# EAGLE design TempGuard (EAGLE 9.6.1)
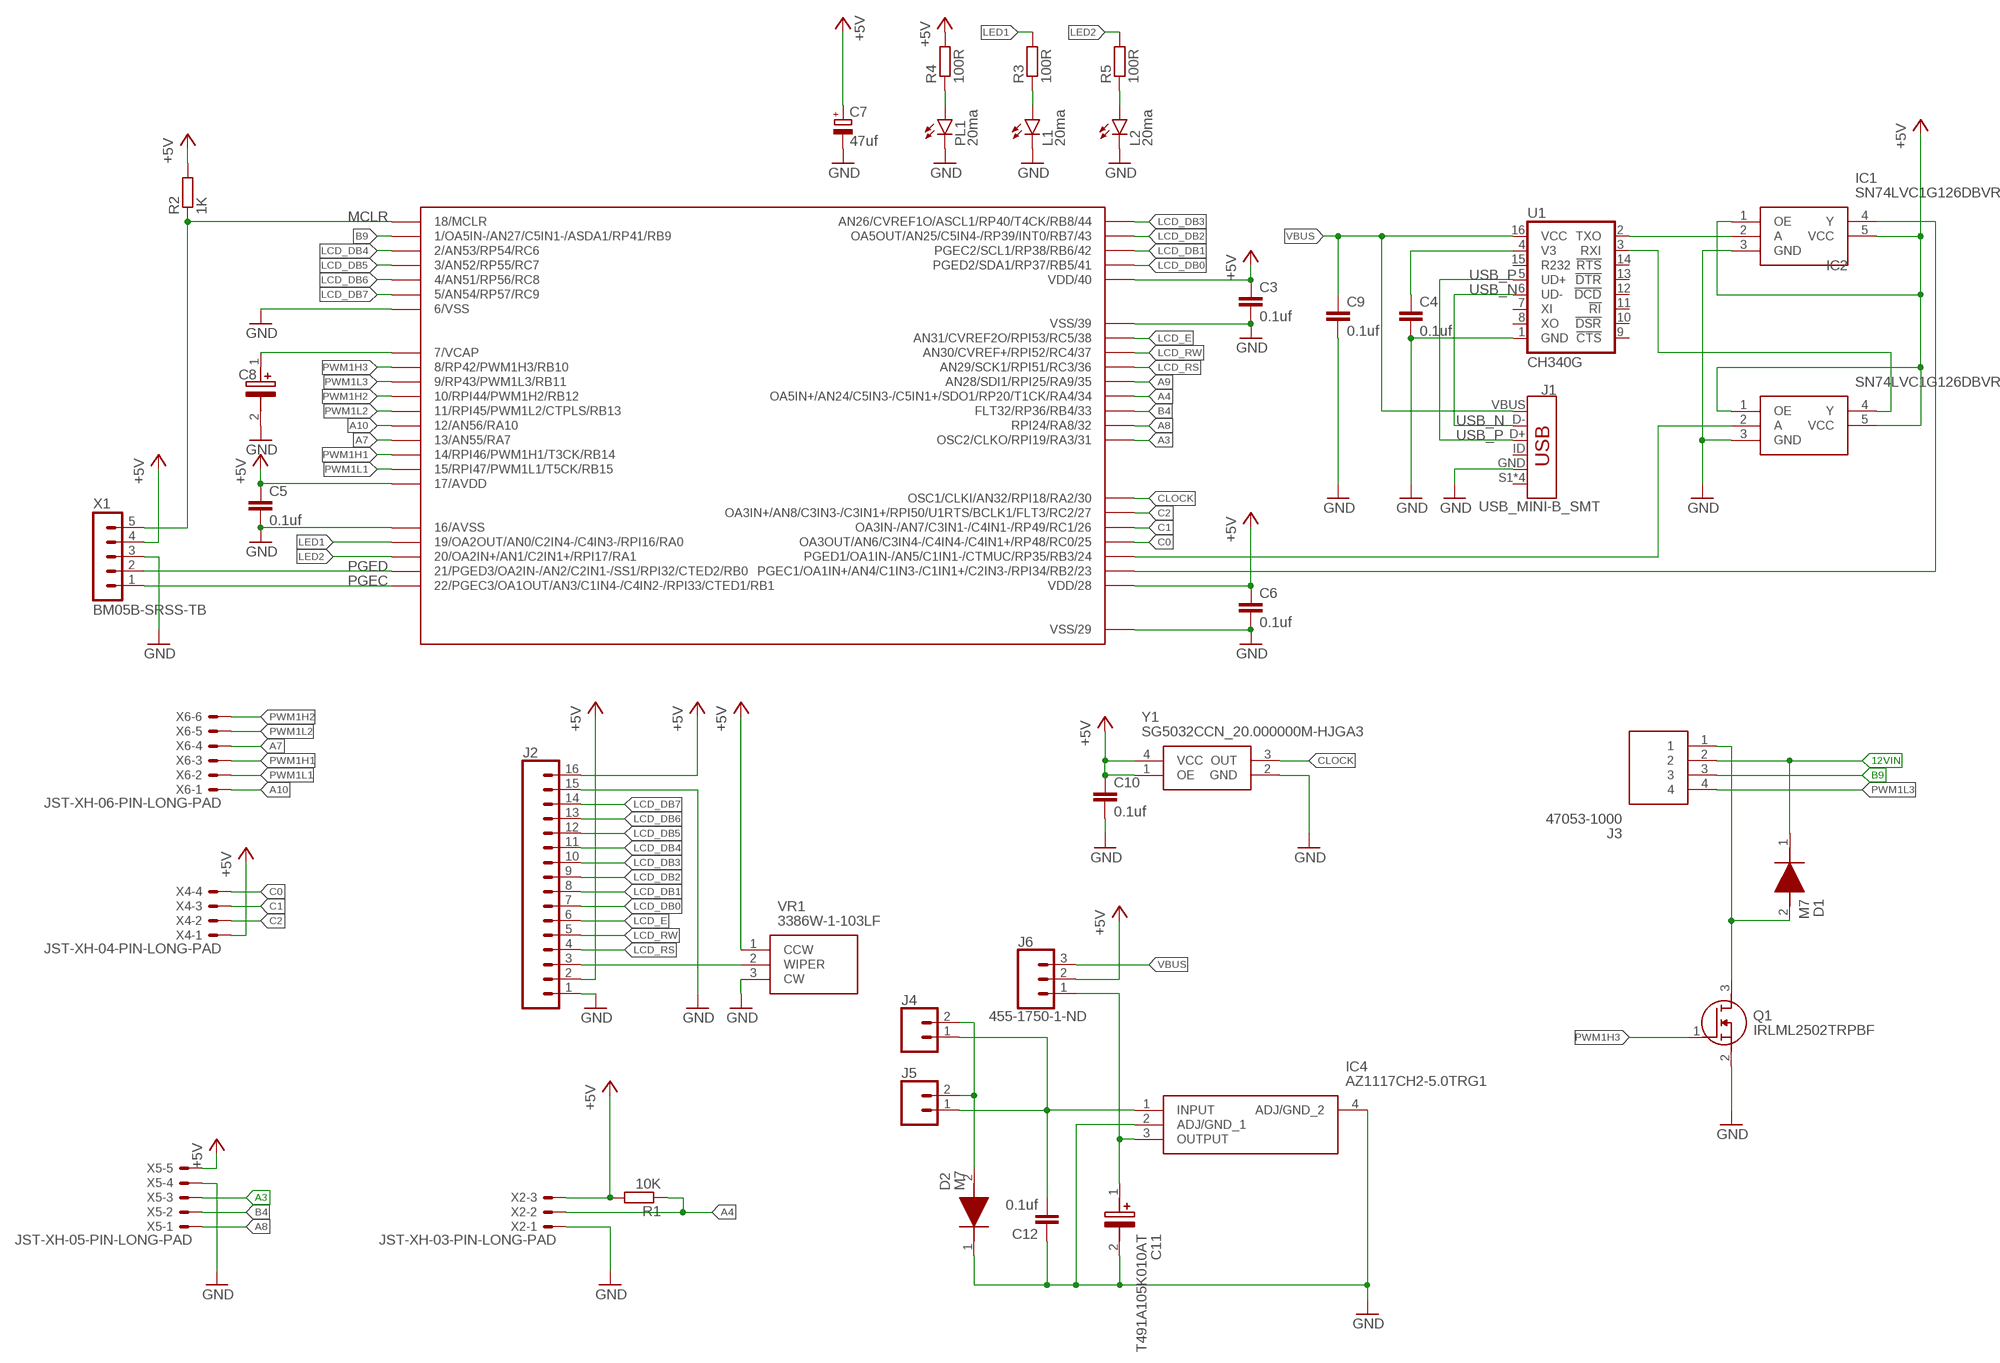
[diagram p0: schematic, sheet 1]

## Parts
C3  0.1uf  C-EUC0805  [C0805]
C4  0.1uf  C-EUC0805  [C0805]
C5  0.1uf  C-EUC0805  [C0805]
C6  0.1uf  C-EUC0805  [C0805]
C7  47uf  CPOL-EUE2-5  [E2-5]
C8  TR3B106K020C1000  [CAPPM3528X210N]
C9  0.1uf  C-EUC0805  [C0805]
C10  0.1uf  C-EUC0805  [C0805]
C11  T491A105K010AT  [T491A]
C12  0.1uf  C-EUC0805  [C0805]
D1  M7  [DIOM5327X240N]
D2  M7  [DIOM5327X240N]
IC1  SN74LVC1G126DBVR  [SOT95P280X145-5N]
IC2  SN74LVC1G126DBVR  [SOT95P280X145-5N]
IC4  AZ1117CH2-5.0TRG1  [SOT230P700X180-4N]
J1  USB_MINI-B_SMT  [USB-MINIB]
J2  CONN_16LONGPADS  [1X16_LONGPADS]
J3  47053-1000  [470531000]
J4  CONN_025MM  [SCREWTERMINAL-5MM-2]
J5  CONN_025MM  [SCREWTERMINAL-5MM-2]
J6  455-1750-1-ND  CONN_03  [1X03]
L1  20ma  LEDSML0805  [SML0805]
L2  20ma  LEDSML0805  [SML0805]
MCU1  DSPIC33EV64GM004-I/PT  [QFP80P1200X1200X120-44]
PL1  20ma  LEDSML0805  [SML0805]
Q1  IRLML2502TRPBF  [SOT95P237X112-3N]
R1  10K  R-EU_R0805  [R0805]
R2  1K  R-EU_R0805  [R0805]
R3  100R  R-EU_R0805  [R0805]
R4  100R  R-EU_R0805  [R0805]
R5  100R  R-EU_R0805  [R0805]
U1  CH340G  CH340GSMD  [SO016]
VR1  3386W-1-103LF  [3386W]
X1  BM05B-SRSS-TB  [BM05B-SRSS-TB]
X2  JST-XH-03-PIN-LONG-PAD  [JST-XH-03-PACKAGE-LONG-PAD]
X4  JST-XH-04-PIN-LONG-PAD  [JST-XH-04-PACKAGE-LONG-PAD]
X5  JST-XH-05-PIN-LONG-PAD  [JST-XH-05-PACKAGE-LONG-PAD]
X6  JST-XH-06-PIN-LONG-PAD  [JST-XH-06-PACKAGE-LONG-PAD]
Y1  SG5032CCN_20.000000M-HJGA3  [SG5032CCN20000000MHJGA3]

## Nets
12VIN [logic]: C12.2 D1.1(K) IC4.1(INPUT) J3.2 J4.1 J5.1
+5V [power]: C3.1 C5.1 C6.1 C7.+ C10.1 IC1.1(OE) IC1.5(VCC) IC2.1(OE) IC2.5(VCC) J2.2 J2.16 J6.2 MCU1.17(17/AVDD) MCU1.28(VDD/28) MCU1.40(VDD/40) R1.2 R2.2 R4.2 VR1.1(CCW) X1.4 X2.3 X4.1 X5.5 Y1.1(OE) Y1.4(VCC)
A3 [logic]: MCU1.31(OSC2/CLKO/RPI19/RA3/31) X5.3
A4 [logic]: MCU1.34(OA5IN+/AN24/C5IN3-/C5IN1+/SDO1/RP20/T1CK/RA4/34) R1.1 X2.2
A7 [logic]: MCU1.13(13/AN55/RA7) X6.4
A8 [logic]: MCU1.32(RPI24/RA8/32) X5.1
A9 [logic]: MCU1.35(AN28/SDI1/RPI25/RA9/35)
A10 [logic]: MCU1.12(12/AN56/RA10) X6.1
B4 [logic]: MCU1.33(FLT32/RP36/RB4/33) X5.2
B9 [logic]: J3.3 MCU1.1(1/OA5IN-/AN27/C5IN1-/ASDA1/RP41/RB9)
C0 [logic]: MCU1.25(OA3OUT/AN6/C3IN4-/C4IN4-/C4IN1+/RP48/RC0/25) X4.4
C1 [logic]: MCU1.26(OA3IN-/AN7/C3IN1-/C4IN1-/RP49/RC1/26) X4.3
C2 [logic]: MCU1.27(OA3IN+/AN8/C3IN3-/C3IN1+/RPI50/U1RTS/BCLK1/FLT3/RC2/27) X4.2
CLOCK [logic]: MCU1.30(OSC1/CLKI/AN32/RPI18/RA2/30) Y1.3(OUT)
GND [power]: C3.2 C4.2 C5.2 C6.2 C7.- C8.2(-) C9.2 C10.2 C11.2(-) C12.1 D2.1(K) IC1.3(GND) IC2.3(GND) IC4.2(ADJ/GND_1) IC4.4(ADJ/GND_2) J1.GND J2.1 J2.15 L1.C L2.C MCU1.6(6/VSS) MCU1.16(16/AVSS) MCU1.29(VSS/29) MCU1.39(VSS/39) PL1.C Q1.2(S) U1.1(GND) VR1.3(CW) X1.3 X2.1 X5.4 Y1.2(GND)
LCD_DB0 [logic]: J2.7 MCU1.41(PGED2/SDA1/RP37/RB5/41)
LCD_DB1 [logic]: J2.8 MCU1.42(PGEC2/SCL1/RP38/RB6/42)
LCD_DB2 [logic]: J2.9 MCU1.43(OA5OUT/AN25/C5IN4-/RP39/INT0/RB7/43)
LCD_DB3 [logic]: J2.10 MCU1.44(AN26/CVREF1O/ASCL1/RP40/T4CK/RB8/44)
LCD_DB4 [logic]: J2.11 MCU1.2(2/AN53/RP54/RC6)
LCD_DB5 [logic]: J2.12 MCU1.3(3/AN52/RP55/RC7)
LCD_DB6 [logic]: J2.13 MCU1.4(4/AN51/RP56/RC8)
LCD_DB7 [logic]: J2.14 MCU1.5(5/AN54/RP57/RC9)
LCD_E [logic]: J2.6 MCU1.38(AN31/CVREF2O/RPI53/RC5/38)
LCD_RS [logic]: J2.4 MCU1.36(AN29/SCK1/RPI51/RC3/36)
LCD_RW [logic]: J2.5 MCU1.37(AN30/CVREF+/RPI52/RC4/37)
LED1 [logic]: MCU1.19(19/OA2OUT/AN0/C2IN4-/C4IN3-/RPI16/RA0) R3.2
LED2 [logic]: MCU1.20(20/OA2IN+/AN1/C2IN1+/RPI17/RA1) R5.2
MCLR [logic]: MCU1.18(18/MCLR) R2.1 X1.5
N$1 [logic]: C4.1 U1.4(V3)
N$2 [logic]: L1.A R3.1
N$3 [power]: D1.2(A) J3.1 Q1.3(D)
N$4 [logic]: IC1.2(A) U1.2(TXO)
N$5 [logic]: J2.3 VR1.2(WIPER)
N$6 [logic]: PL1.A R4.1
N$7 [logic]: L2.A R5.1
N$8 [power]: D2.2(A) J4.2 J5.2
N$9 [power]: C11.1(+) IC4.3(OUTPUT) J6.1
N$14 [logic]: IC2.4(Y) U1.3(RXI)
PGEC [logic]: MCU1.22(22/PGEC3/OA1OUT/AN3/C1IN4-/C4IN2-/RPI33/CTED1/RB1) X1.1
PGED [logic]: MCU1.21(21/PGED3/OA2IN-/AN2/C2IN1-/SS1/RPI32/CTED2/RB0) X1.2
PWM1H1 [logic]: MCU1.14(14/RPI46/PWM1H1/T3CK/RB14) X6.3
PWM1H2 [logic]: MCU1.10(10/RPI44/PWM1H2/RB12) X6.6
PWM1H3 [logic]: MCU1.8(8/RP42/PWM1H3/RB10) Q1.1(G)
PWM1L1 [logic]: MCU1.15(15/RPI47/PWM1L1/T5CK/RB15) X6.2
PWM1L2 [logic]: MCU1.11(11/RPI45/PWM1L2/CTPLS/RB13) X6.5
PWM1L3 [logic]: J3.4 MCU1.9(9/RP43/PWM1L3/RB11)
U1RX [logic]: IC1.4(Y) MCU1.23(PGEC1/OA1IN+/AN4/C1IN3-/C1IN1+/C2IN3-/RPI34/RB2/23)
U1TX [logic]: IC2.2(A) MCU1.24(PGED1/OA1IN-/AN5/C1IN1-/CTMUC/RP35/RB3/24)
USB_N [logic]: J1.D- U1.6(UD-)
USB_P [logic]: J1.D+ U1.5(UD+)
VBUS [logic]: C9.1 J1.VBUS J6.3 U1.16(VCC)
VCAP [logic]: C8.1(+) MCU1.7(7/VCAP)
Unconnected: J1.ID J1.S1(SHIELD) J1.S2(SHIELD) J1.S3(SHIELD) J1.S4(SHIELD) U1.7(XI) U1.8(XO) U1.9(!CTS) U1.10(!DSR) U1.11(!RI) U1.12(!DCD) U1.13(!DTR) U1.14(!RTS) U1.15(R232)

## Library data of the parts
C3-C6 C9 C10 C12 = rcl:C-EU: CAPACITOR, European symbol; SPICEPREFIX: C
C7 = rcl:CPOL-EU: POLARIZED CAPACITOR, European symbol; SPICEPREFIX: C
C8 = Angelo-Capacitors:TR3B106K020C1000: Solid Tantalum Surface Mount Chip Capacitors TANTAMOUNT(TM), Molded Case, Low ESR Source: Datasheet <http://www.vishay.com/doc?40080>; ALLIED_NUMBER: 70396682; DESCRIPTION: Solid Tantalum Surface Mount Chip Capacitors TANTAMOUNT(TM), Molded Case, Low ESR; HEIGHT: 2.1mm; MANUFACTURER_NAME: Vishay; MANUFACTURER_PART_NUMBER: TR3B106K020C1000; RS_PART_NUMBER: 6845020; RS_PRICE-STOCK: https://uk.rs-online.com/web/p/products/6845020; VALUEX: 10uF
C11 = T491A105K010AT:T491A105K010AT: T491, Tantalum, MnO2 Tantalum, Commercial Grade, 1 uF, 10%, 10 VDC, 125C, -55C, 85C, SMD, MnO2, Molded, 4 % , 10 Ohms, 500 nA, 58.6 mg, 3216, 1.6mm, Height Max = 1.8mm, 2000, 156 Weeks Source: Datasheet <https://content.kemet.com/datasheets/KEM_T2005_T491.pdf>; DESCRIPTION: T491, Tantalum, MnO2 Tantalum, Commercial Grade, 1 uF, 10%, 10 VDC, 125C, -55C, 85C, SMD, MnO2, Molded, 4 % , 10 Ohms, 500 nA, 58.6 mg, 3216, 1.6mm, Height Max = 1.8mm, 2000, 156 Weeks; HEIGHT: 1.8mm; MANUFACTURER_NAME: KEMET; MANUFACTURER_PART_NUMBER: T491A105K010AT; MOUSER_PART_NUMBER: 80-T491A105K010AT; MOUSER_PRICE-STOCK: https://www.mouser.co.uk/ProductDetail/KEMET/T491A105K010AT?qs=AaRlLUpeMswm%2FLee9GNRtw%3D%3D
D1 D2 = M7:M7: Standard recovery rectifier diode Source: Datasheet <https://www.mouser.in/datasheet/2/849/m1-2577421.pdf>; DESCRIPTION: Standard recovery rectifier diode; HEIGHT: 2.4mm; MANUFACTURER_NAME: Diotec; MANUFACTURER_PART_NUMBER: M7; MOUSER_PART_NUMBER: 637-M7; MOUSER_PRICE-STOCK: https://www.mouser.co.uk/ProductDetail/Diotec-Semiconductor/M7?qs=OlC7AqGiEDln9itgkDD%2F2A%3D%3D
IC1 IC2 = SN74LVC1G126DBVR:SN74LVC1G126DBVR: Texas Instruments SN74LVC1G126DBVR, Buffer 3-State, Non-Inverting, 1.65 5.5 V, 5-Pin SOT-23 Source: Datasheet <http://www.ti.com/lit/ds/symlink/sn74lvc1g126.pdf>; DESCRIPTION: Texas Instruments SN74LVC1G126DBVR, Buffer 3-State, Non-Inverting, 1.65 5.5 V, 5-Pin SOT-23; HEIGHT: 1.45mm; MANUFACTURER_NAME: Texas Instruments; MANUFACTURER_PART_NUMBER: SN74LVC1G126DBVR; MOUSER_PART_NUMBER: 595-SN74LVC1G126DBVR; MOUSER_PRICE-STOCK: https://www.mouser.co.uk/ProductDetail/Texas-Instruments/SN74LVC1G126DBVR?qs=pajgIaoyDUi3T2WgNNfd3w%3D%3D
IC4 = AZ1117CH2-5.0TRG1:AZ1117CH2-5.0TRG1: LDO Voltage Regulators LDO BJT HiCurr Source: Datasheet <https://www.arrow.com/en/products/az1117ch2-5.0trg1/diodes-incorporated>; DESCRIPTION: LDO Voltage Regulators LDO BJT HiCurr; HEIGHT: 1.8mm; MANUFACTURER_NAME: Diodes Incorporated; MANUFACTURER_PART_NUMBER: AZ1117CH2-5.0TRG1; MOUSER_PART_NUMBER: 621-AZ1117CH2-5.0TRG; MOUSER_PRICE-STOCK: https://www.mouser.co.uk/ProductDetail/Diodes-Incorporated/AZ1117CH2-5.0TRG1?qs=5V6w%252Be2aIqb578qtLdqPjw%3D%3D
J1 = SparkFun-Connectors:USB_MINI-B: USB type Mini-B Connector Breaks out 5th pin, and includes shield pins if needed. SparkFun Products: SparkFun FTDI Basic Breakout <https://www.sparkfun.com/products/9716> SparkFun XBee Explorer USB <https://www.sparkfun.com/products/11812> SparkFun Redboard <https://www.sparkfun.com/products/12757>; PROD_ID: CONN-08193; SF_ID: PRT-00587
J2 = SparkFun-Connectors:CONN_16: Multi connection point. Often used as Generic Header-pin footprint for 0.1 inch spaced/style header connections On any of the 0.1 inch spaced packages, you can populate with these: Break Away Headers - Straight <https://www.sparkfun.com/products/116> (PRT-00116) Break Away Male Headers - Right Angle <https://www.sparkfun.com/products/553> (PRT-00553) Female Headers <https://www.sparkfun.com/products/115> (PRT-00115) Break Away Headers - Machine Pin <https://www.sparkfun.com/products/117> (PRT-00117) Break Away Female Headers - Swiss Machine Pin <https://www.sparkfun.com/products/743> (PRT-00743) For SCREWTERMINALS and SPRING TERMINALS visit here: Screw Terimnals on SparkFun.com <https://www.sparkfun.com/search/results?term=Screw+Terminals> (5mm/3.5mm/2.54mm spacing) This device is also useful as a general connection point to wire up your design to another part of your project. Our various solder wires solder well into these plated through hole pads. Hook-Up Wire - Assortment (Stranded, 22 AWG) <https://www.sparkfun.com/products/11375> (PRT-11375) Hook-Up Wire - Assortment (Solid Core, 22 AWG) <https://www.sparkfun.com/products/11367> (PRT-11367) View the entire wire category on our website here <https://www.sparkfun.com/categories/141> Special notes: Molex polarized connector foot print use with SKU : PRT-08231 with associated crimp pins and housings. 1MM SMD Version SKU: PRT-10208 NOTES ON THE VARIANTS LOCK and LOCK_LONGPADS... This footprint was designed to help hold the alignment of a through-hole component (i.e. 6-pin header) while soldering it into place. You may notice that each hole has been shifted either up or down by 0.005 of an inch from it's more standard position (which is a perfectly straight line). This slight alteration caused the pins (the squares in the middle) to touch the edges of the holes. Because they are alternating, it causes a "brace" to hold the component in place. 0.005 has proven to be the perfect amount of "off-center" position when using our standard breakaway headers. Although looks a little odd when you look at the bare footprint, once you have a header in there, the alteration is very hard to notice. Also,if you push a header all the way into place, it is covered up entirely on the bottom side.
J3 = 47053-1000:47053-1000: MOLEX - 47053-1000 - HEADER, 4POS, 1ROW, 2.54MM Source: Datasheet <http://www.molex.com/pdm_docs/sd/470531000_sd.pdf>; DESCRIPTION: MOLEX - 47053-1000 - HEADER, 4POS, 1ROW, 2.54MM; HEIGHT: 8mm; MANUFACTURER_NAME: Molex; MANUFACTURER_PART_NUMBER: 47053-1000; MOUSER_PART_NUMBER: 538-47053-1000; MOUSER_PRICE-STOCK: https://www.mouser.co.uk/ProductDetail/Molex/47053-1000?qs=ph4zPCVRuvqoDX7hrEhxNA%3D%3D
J4 J5 = SparkFun-Connectors:CONN_02: Multi connection point. Often used as Generic Header-pin footprint for 0.1 inch spaced/style header connections On any of the 0.1 inch spaced packages, you can populate with these: Break Away Headers - Straight <https://www.sparkfun.com/products/116> (PRT-00116) Break Away Male Headers - Right Angle <https://www.sparkfun.com/products/553> (PRT-00553) Female Headers <https://www.sparkfun.com/products/115> (PRT-00115) Break Away Headers - Machine Pin <https://www.sparkfun.com/products/117> (PRT-00117) Break Away Female Headers - Swiss Machine Pin <https://www.sparkfun.com/products/743> (PRT-00743) For SCREWTERMINALS and SPRING TERMINALS visit here: Screw Terimnals on SparkFun.com <https://www.sparkfun.com/search/results?term=Screw+Terminals> (5mm/3.5mm/2.54mm spacing) This device is also useful as a general connection point to wire up your design to another part of your project. Our various solder wires solder well into these plated through hole pads. Hook-Up Wire - Assortment (Stranded, 22 AWG) <https://www.sparkfun.com/products/11375> (PRT-11375) Hook-Up Wire - Assortment (Solid Core, 22 AWG) <https://www.sparkfun.com/products/11367> (PRT-11367) View the entire wire category on our website here <https://www.sparkfun.com/categories/141> Special notes: Molex polarized connector foot print use with: PRT-08233 with associated crimp pins and housings. 2.54_SCREWTERM for use with PRT-10571. 3.5mm Screw Terminal footprints for PRT-08084 5mm Screw Terminal footprints for use with PRT-08432; SF_SKU: PRT-08432
J6 = SparkFun-Connectors:CONN_03: Multi connection point. Often used as Generic Header-pin footprint for 0.1 inch spaced/style header connections On any of the 0.1 inch spaced packages, you can populate with these: Break Away Headers - Straight <https://www.sparkfun.com/products/116> (PRT-00116) Break Away Male Headers - Right Angle <https://www.sparkfun.com/products/553> (PRT-00553) Female Headers <https://www.sparkfun.com/products/115> (PRT-00115) Break Away Headers - Machine Pin <https://www.sparkfun.com/products/117> (PRT-00117) Break Away Female Headers - Swiss Machine Pin <https://www.sparkfun.com/products/743> (PRT-00743) Stackable Header - 3 Pin (Female, 0.1") <https://www.sparkfun.com/products/13875> (PRT-13875) For SCREWTERMINALS and SPRING TERMINALS visit here: Screw Terimnals on SparkFun.com <https://www.sparkfun.com/search/results?term=Screw+Terminals> (5mm/3.5mm/2.54mm spacing) This device is also useful as a general connection point to wire up your design to another part of your project. Our various solder wires solder well into these plated through hole pads. Hook-Up Wire - Assortment (Stranded, 22 AWG) <https://www.sparkfun.com/products/11375> (PRT-11375) Hook-Up Wire - Assortment (Solid Core, 22 AWG) <https://www.sparkfun.com/products/11367> (PRT-11367) View the entire wire category on our website here <https://www.sparkfun.com/categories/141> Special notes: Molex polarized connector foot print use with SKU : PRT-08232 with associated crimp pins and housings.; PROD_ID: XXX-00000
L1 L2 PL1 = led:LED: LED OSRAM: - CHIPLED LG R971, LG N971, LY N971, LG Q971, LY Q971, LO R971, LY R971 LH N974, LH R974 LS Q976, LO Q976, LY Q976 LO Q996 - Hyper CHIPLED LW Q18S LB Q993, LB Q99A, LB R99A - SideLED LS A670, LO A670, LY A670, LG A670, LP A670 LB A673, LV A673, LT A673, LW A673 LH A674 LY A675 LS A676, LA A676, LO A676, LY A676, LW A676 LS A679, LY A679, LG A679 - Hyper Micro SIDELED® LS Y876, LA Y876, LO Y876, LY Y876 LT Y87S - SmartLED LW L88C, LW L88S LB L89C, LB L89S, LG L890 LS L89K, LO L89K, LY L89K LS L896, LA L896, LO L896, LY L896 - TOPLED LS T670, LO T670, LY T670, LG T670, LP T670 LSG T670, LSP T670, LSY T670, LOP T670, LYG T670 LG T671, LOG T671, LSG T671 LB T673, LV T673, LT T673, LW T673 LH T674 LS T676, LA T676, LO T676, LY T676, LB T676, LH T676, LSB T676, LW T676 LB T67C, LV T67C, LT T67C, LS T67K, LO T67K, LY T67K, LW E67C LS E67B, LA E67B, LO E67B, LY E67B, LB E67C, LV E67C, LT E67C LW T67C LS T679, LY T679, LG T679 LS T770, LO T770, LY T770, LG T770, LP T770 LB T773, LV T773, LT T773, LW T773 LH T774 LS E675, LA E675, LY E675, LS T675 LS T776, LA T776, LO T776, LY T776, LB T776 LHGB T686 LT T68C, LB T68C - Hyper Mini TOPLED® LB M676 - Mini TOPLED Santana® LG M470 LS M47K, LO M47K, LY M47K Source: http://www.osram.convergy.de LUXEON: - LUMILED® LXK2-PW12-R00, LXK2-PW12-S00, LXK2-PW14-U00, LXK2-PW14-V00 LXK2-PM12-R00, LXK2-PM12-S00, LXK2-PM14-U00 LXK2-PE12-Q00, LXK2-PE12-R00, LXK2-PE12-S00, LXK2-PE14-T00, LXK2-PE14-U00 LXK2-PB12-K00, LXK2-PB12-L00, LXK2-PB12-M00, LXK2-PB14-N00, LXK2-PB14-P00, LXK2-PB14-Q00 LXK2-PR12-L00, LXK2-PR12-M00, LXK2-PR14-Q00, LXK2-PR14-R00 LXK2-PD12-Q00, LXK2-PD12-R00, LXK2-PD12-S00 LXK2-PH12-R00, LXK2-PH12-S00 LXK2-PL12-P00, LXK2-PL12-Q00, LXK2-PL12-R00 Source: www.luxeon.com KINGBRIGHT: KA-3528ASYC Source: www.kingbright.com
MCU1 = Angelo-Microcontrollers:DSPIC33EV64GM004-I/PT: dsPIC33EV64GM004-I/PT
Q1 = IRLML2502TRPBF:IRLML2502TRPBF: IRLML2502TRPBF N-Channel MOSFET, 4.2 A, 20 V IRLML2502, 3-Pin SOT-23 Infineon Source: Datasheet; DESCRIPTION: IRLML2502TRPBF N-Channel MOSFET, 4.2 A, 20 V IRLML2502, 3-Pin SOT-23 Infineon; HEIGHT: 1.12mm; MANUFACTURER_NAME: Infineon; MANUFACTURER_PART_NUMBER: IRLML2502TRPBF; MOUSER_PART_NUMBER: 942-IRLML2502TRPBF; MOUSER_PRICE-STOCK: https://www.mouser.co.uk/ProductDetail/Infineon-Technologies/IRLML2502TRPBF?qs=9%252BKlkBgLFf37zQw9UlZd%2FQ%3D%3D
R1-R5 = rcl:R-EU_: RESISTOR, European symbol; SPICEPREFIX: R
U1 = SparkFun-IC-Comms:CH340G: A simple USB 2.0 to Serial IC.; PROD_ID: IC-13498
VR1 = 3386W-1-103LF:3386W-1-103LF: Trimmer Resistors - Through Hole 3/8" 10Kohms 10% 0.5Watts Square Source: Datasheet <https://www.bourns.com/pdfs/3386.pdf>; DESCRIPTION: Trimmer Resistors - Through Hole 3/8" 10Kohms 10% 0.5Watts Square; HEIGHT: mm; MANUFACTURER_NAME: Bourns; MANUFACTURER_PART_NUMBER: 3386W-1-103LF; MOUSER_PART_NUMBER: 652-3386W-1-103LF; MOUSER_PRICE-STOCK: https://www.mouser.co.uk/ProductDetail/Bourns/3386W-1-103LF?qs=0VqvB9JLnItKvPGevjBaLA%3D%3D
X1 = con-JST SH:BM05B-SRSS: JST SH series header 1.00mm pitch disconnectable crimp style connectors, vertical (side entry type), 5 pins
X2 = Rembrandt Electronics - JST XH Connectors v1-0:JST-XH-03-PIN: JST XH Connector 2 Pin Wire to board connector. Pitch: 2,54 mm, (0.100") Number of pins: 3 Created by Rembrandt Electronics www.rembrandtelectronics.com
X4 = Rembrandt Electronics - JST XH Connectors v1-0:JST-XH-04-PIN: JST XH Connector 2 Pin Wire to board connector. Pitch: 2,54 mm, (0.100") Number of pins: 4 Created by Rembrandt Electronics www.rembrandtelectronics.com
X5 = Rembrandt Electronics - JST XH Connectors v1-0:JST-XH-05-PIN: JST XH Connector 2 Pin Wire to board connector. Pitch: 2,54 mm, (0.100") Number of pins: 5 Created by Rembrandt Electronics www.rembrandtelectronics.com
X6 = Rembrandt Electronics - JST XH Connectors v1-0:JST-XH-06-PIN: JST XH Connector 2 Pin Wire to board connector. Pitch: 2,54 mm, (0.100") Number of pins: 6 Created by Rembrandt Electronics www.rembrandtelectronics.com
Y1 = angeo-SG5032CCN_20.000000M-HJGA3:SG5032CCN_20.000000M-HJGA3: Standard Clock Oscillators 20MHz 50ppm -40C +85C Source: Datasheet <https://componentsearchengine.com/Datasheets/1/SG5032CCN 20.000000M-HJGA3.pdf>; DESCRIPTION: Standard Clock Oscillators 20MHz 50ppm -40C +85C; HEIGHT: 1.3mm; MANUFACTURER_NAME: Epson Timing; MANUFACTURER_PART_NUMBER: SG5032CCN 20.000000M-HJGA3; MOUSER_PART_NUMBER: 732-5032CCN20.0HJGA3; MOUSER_PRICE-STOCK: https://www.mouser.co.uk/ProductDetail/Epson-Timing/SG5032CCN-20.000000M-HJGA3?qs=6J2kD0vu%2F2U2U6P0qrgWFg%3D%3D

## Net classes
0 default: width 0.203 mm, drill 0.254 mm, clearance 0.203 mm
1 logic: width 0.203 mm, drill 0.254 mm, clearance 0.203 mm
2 power: width 0.406 mm, drill 0.254 mm, clearance 0.203 mm

## Board
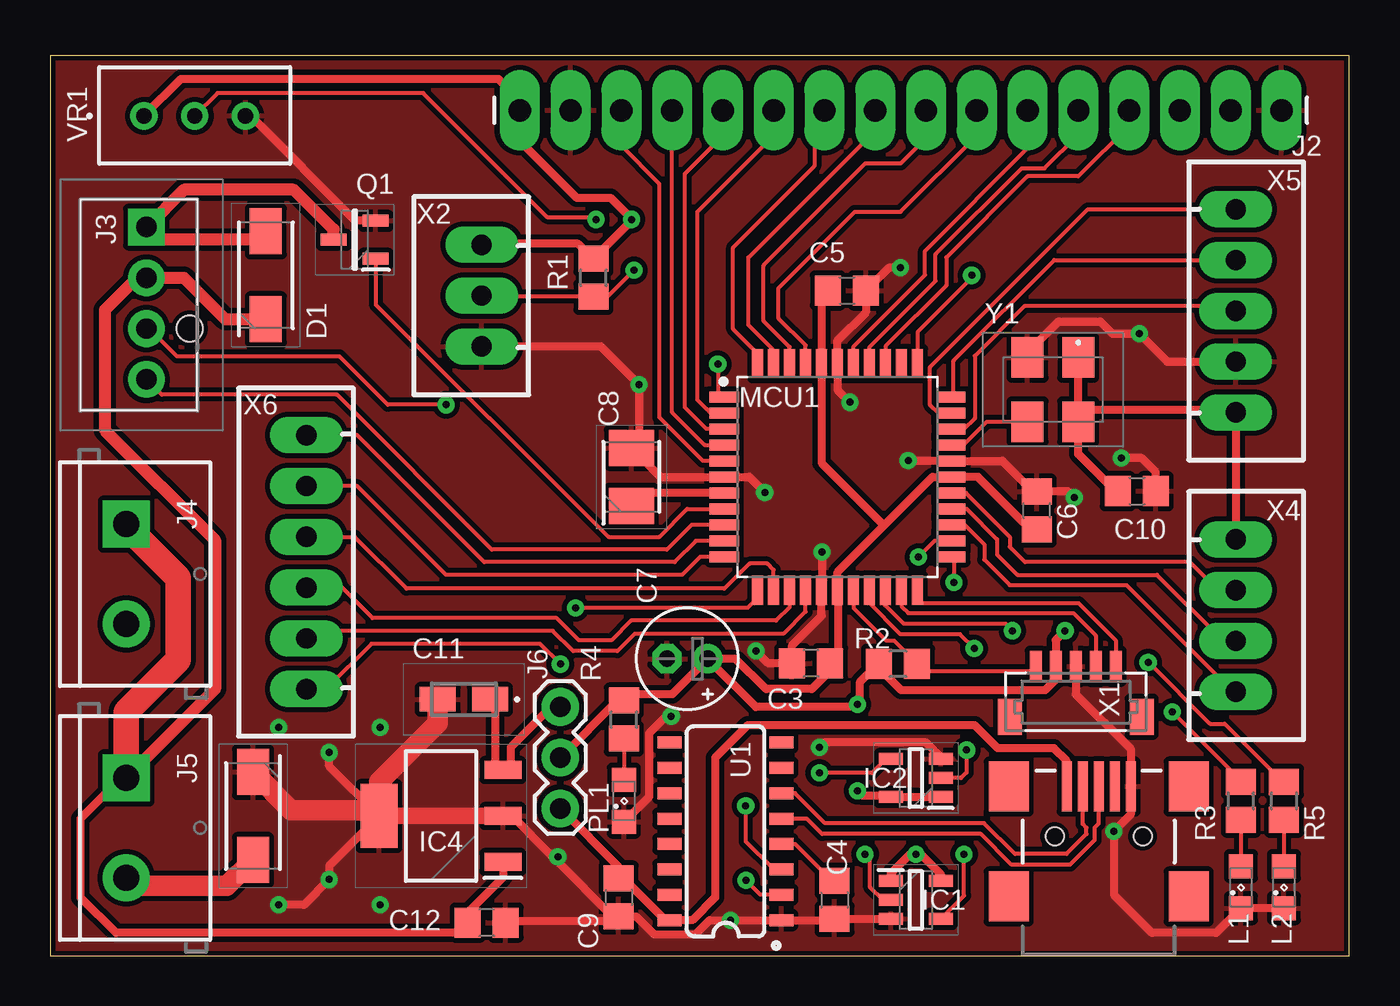
[diagram p1: board, top side]
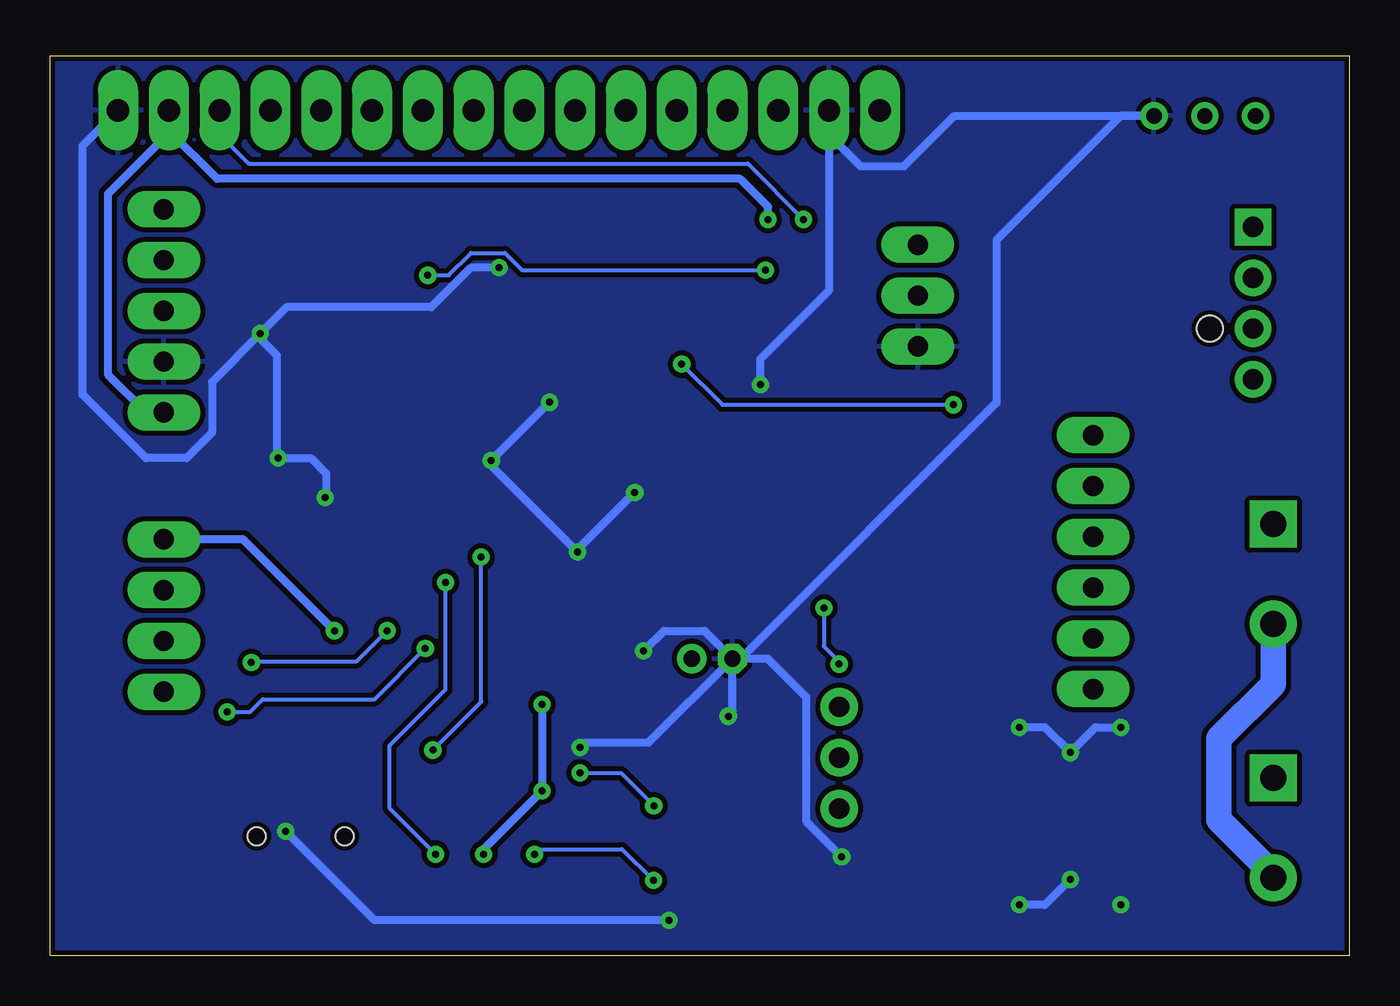
[diagram p2: board, bottom side, seen from below]

Size 65 x 45.01 mm. Coordinates in mm from the lower left corner, seen from the top.
Outline: 0,0 65,0 65,45.01 0,45.01 0,0
Copper layers (1*16): Top 0.035mm / dielectric 1.6mm / Bottom 0.035mm
Design rules "jlcpcb-2layers *": minimum track width 5mil, minimum drill 0.3mm, track to track 6mil, track to pad 6mil, pad to pad 6mil, via to via 6mil, smd to smd 6mil, copper to edge 0.2mm, drill to drill 8mil, minimum pad ring 10mil, minimum via ring 10mil, stop-mask expansion 4mil, vias tented up to drill 0mil, thermal gap 10mil

### Footprints (pad centres in the part's own frame; a part is rotated, then mirrored left to right if it is on the bottom)
C0805 = smd 1.3 x 1.5: 1 -0.95,0; 2 0.95,0
E2-5 = drill 0.813 pad 1.27: + -1.016,0 | drill 0.813 pad 1.27 octagon: - 1.016,0
CAPPM3528X210N = smd 1.8 x 2.25: 1 -1.45,0; 2 1.45,0
T491A = smd 1.8 x 1.23: 1 -1.31,0; 2 1.31,0
DIOM5327X240N = smd 2.3 x 1.6: 1 -2.2,0; 2 2.2,0
SOT95P280X145-5N = smd 1.2 x 0.6: 1 -1.25,0.95; 2 -1.25,0; 3 -1.25,-0.95; 4 1.25,-0.95; 5 1.25,0.95
SOT230P700X180-4N = smd 1.85 x 0.9: 1 -3.1,2.3; 2 -3.1,0; 3 -3.1,-2.3 | smd 1.85 x 3.2: 4 3.1,0
USB-MINIB = smd 2.5 x 0.5: D+ 2.5,0; D- 2.5,0.8; GND 2.5,-1.6; ID 2.5,-0.8; VBUS 2.5,1.6 | smd 2.5 x 2: S1 -3,4.5; S2 2.5,4.5; S3 -3,-4.5; S4 2.5,-4.5 | hole 0.9: 0,2.2; 0,-2.2
1X16_LONGPADS = drill 1.118 pad 1.88 long: 1 0,0; 2 2.54,0; 3 5.08,0; 4 7.62,0; 5 10.16,0; 6 12.7,0; 7 15.24,0; 8 17.78,0; 9 20.32,0; 10 22.86,0; 11 25.4,0; 12 27.94,0; 13 30.48,0; 14 33.02,0; 15 35.56,0; 16 38.1,0
470531000 = drill 1.02 pad 1.53 square: 1 0,0 | drill 1.02 pad 1.55: 2 -2.54,0; 3 -5.08,0; 4 -7.62,0 | hole 1.3: -5.08,-2.16
SCREWTERMINAL-5MM-2 = drill 1.3 pad 2.032 square: 1 0,0 | drill 1.3 pad 2.032: 2 5,0
1X03 = drill 1.016 pad 1.88: 1 0,0; 2 2.54,0; 3 5.08,0
SML0805 = smd 1.2 x 1.2: A 1.05,0; C -1.05,0
QFP80P1200X1200X120-44 = smd 1.469 x 0.547: 1 -5.671,4; 2 -5.671,3.2; 3 -5.671,2.4; 4 -5.671,1.6; 5 -5.671,0.8; 6 -5.671,0; 7 -5.671,-0.8; 8 -5.671,-1.6; 9 -5.671,-2.4; 10 -5.671,-3.2; 11 -5.671,-4; 23 5.671,-4; 24 5.671,-3.2; 25 5.671,-2.4; 26 5.671,-1.6; 27 5.671,-0.8; 28 5.671,0; 29 5.671,0.8; 30 5.671,1.6; 31 5.671,2.4; 32 5.671,3.2; 33 5.671,4 | smd 0.547 x 1.469: 12 -4,-5.671; 13 -3.2,-5.671; 14 -2.4,-5.671; 15 -1.6,-5.671; 16 -0.8,-5.671; 17 0,-5.671; 18 0.8,-5.671; 19 1.6,-5.671; 20 2.4,-5.671; 21 3.2,-5.671; 22 4,-5.671; 34 4,5.671; 35 3.2,5.671; 36 2.4,5.671; 37 1.6,5.671; 38 0.8,5.671; 39 0,5.671; 40 -0.8,5.671; 41 -1.6,5.671; 42 -2.4,5.671; 43 -3.2,5.671; 44 -4,5.671
SOT95P237X112-3N = smd 1.3 x 0.6: 1 -1.05,0.95; 2 -1.05,-0.95; 3 1.05,0
R0805 = smd 1.3 x 1.5: 1 -0.95,0; 2 0.95,0
SO016 = smd 0.6 x 1.2: 1 -4.445,-2.8; 2 -3.175,-2.8; 3 -1.905,-2.8; 4 -0.635,-2.8; 5 0.635,-2.8; 6 1.905,-2.8; 7 3.175,-2.8; 8 4.445,-2.8; 9 4.445,2.8; 10 3.175,2.8; 11 1.905,2.8; 12 0.635,2.8; 13 -0.635,2.8; 14 -1.905,2.8; 15 -3.175,2.8; 16 -4.445,2.8
3386W = drill 0.76 pad 1.26: 1 -2.54,-2.44; 2 0,-2.44; 3 2.54,-2.44
BM05B-SRSS-TB = smd 0.6 x 1.55: 1 2,0; 2 1,0; 3 0,0; 4 -1,0; 5 -2,0 | smd 1.2 x 1.8: M1 3.3,-2.525; M2 -3.3,-2.525
JST-XH-03-PACKAGE-LONG-PAD = drill 1.016 long: 1 -2.54,0; 2 0,0; 3 2.54,0
JST-XH-04-PACKAGE-LONG-PAD = drill 1.016 long: 1 -3.81,0; 2 -1.27,0; 3 1.27,0; 4 3.81,0
JST-XH-05-PACKAGE-LONG-PAD = drill 1.016 long: 1 -5.08,0; 2 -2.54,0; 3 0,0; 4 2.54,0; 5 5.08,0
JST-XH-06-PACKAGE-LONG-PAD = drill 1.016 long: 1 -6.35,0; 2 -3.81,0; 3 -1.27,0; 4 1.27,0; 5 3.81,0; 6 6.35,0
SG5032CCN20000000MHJGA3 = smd 1.6 x 2.032: 1 -1.27,-1.608; 2 1.27,-1.608; 3 1.27,1.608; 4 -1.27,1.608

### Placement (x,y rotation side)
C3  38.07,14.63 180 top
C4  39.24,2.79 270 top
C5  39.86,33.27 0 top
C6  49.35,22.27 90 top
C7  31.88,14.86 180 top
C8  29.08,23.95 90 top
C9  28.45,2.92 270 top
C10  54.36,23.24 0 top
C11  20.7,12.83 180 top
C12  21.84,1.65 180 top
D1  10.79,34.04 90 top
D2  10.16,6.99 270 top
IC1  43.31,2.79 0 top
IC2  43.31,8.89 180 top
IC4  19.56,6.99 180 top
J1  52.45,5.97 90 top
J2  61.59,42.29 180 top
J3  4.83,36.45 90 top
J4  3.81,21.59 270 top
J5  3.81,8.89 270 top
J6  25.53,12.45 270 top
L1  59.56,3.43 90 top
L2  61.72,3.43 90 top
MCU1  39.39,23.95 0 top
PL1  28.7,7.75 90 top
Q1  15.24,35.81 180 top
R1  27.18,33.91 90 top
R2  42.42,14.61 180 top
R3  59.56,7.75 90 top
R4  28.7,11.81 90 top
R5  61.72,7.75 90 top
U1  33.78,6.22 90 top
VR1  7.24,44.45 0 top
X1  51.31,14.48 0 top
X2  21.59,33.02 90 top
X4  59.31,17.02 270 top
X5  59.31,32.26 270 top
X6  12.83,19.68 90 top
Y1  50.16,28.32 180 top

### Tracks (layer width: path | path; a pad name or v marks a point on that pad's centre or on a via)
12VIN
  Top 0.406: IC4.1 22.66,3.92 20.95,2.22 20.95,1.71 C12.2 20.39,1.14 3.3,1.14 1.52,2.92 1.52,6.86 3.56,8.89 J5.1 | J3.2 4.35,33.91
  Top 0.61: J5.1 8.26,13.34 8.26,20.79 2.74,26.3 2.74,32.3 4.35,33.91 | 3.81,21.49 J4.1 | J3.2 6.69,33.91 8.76,31.84 D1.1
  Top 1.27: 3.81,21.49 6.4,18.89 6.4,14.79 3.81,12.2 J5.1
+5V  (via drill 0.35)
  Top 0.406: C5.1 38.59,32.95 MCU1.40 38.59,24.66 41.72,21.53 | C6.1 49.04,21.32 47.54,22.82 46.42,23.95 MCU1.28 44.14,23.95 41.72,21.53 | C7.+ 34.29,14.86 35.81,13.34 38.1,13.34 39.02,14.26 C3.1 39.4,15.01 39.4,18.26 MCU1.17 39.39,19.2 41.72,21.53 | 41.44,14.63 41.7,14.63 41.47,14.4 42.57,13.3 49.78,13.3 50.31,13.83 X1.4 50.31,15.8 v50.77,16.26 | 41.44,14.63 R2.2 | IC2.1 IC2.5 42,8 40.64,8 v40.39,8.26 | C7.+ 31.11,13.08 29.02,13.08 R4.2 28.38,12.76 J6.2 | IC1.1 42.06,4.12 43.01,5.08 v43.31,5.08 43.56,5.08 44.56,4.08 IC1.5 | C7.+ 35.31,12.45 40.26,12.45 v40.39,12.57 40.51,12.7 40.51,13.7 41.44,14.63 | VR1.1 6.55,43.86 22.42,43.86 23.5,42.79 J2.16 23.5,40.77 26.34,37.92 28.03,37.92 29.08,36.87 v29.08,36.83 29.08,36.76 R1.2 26.42,35.62 21.65,35.62 X2.3 | Y1.4 51.44,25.09 53.28,23.24 C10.1 | Y1.4 Y1.1 | X4.1 X5.5 59.18,27.3 52.03,27.3 Y1.4
  Bottom 0.406: v43.31,5.08 43.31,5.33 v40.39,8.26 v40.39,12.57 | v29.08,36.83 29.08,37.47 30.48,38.86 56.64,38.86 59.05,41.27 J2.2 59.18,42.16 59.18,41.02 62.1,38.1 62.1,29.08 60.2,27.18 X5.5 | v50.77,16.26 55.34,20.83 X4.1
A3
  Top 0.203: MCU1.31 45.09,26.32 45.69,26.32 46.25,26.88 46.25,30 48.77,32.51 53.34,32.51 53.85,32.51 59.05,32.51 X5.3
A4  (via drill 0.35)
  Top 0.203: X2.2 21.65,32.96 R1.1 27.88,32.96 v29.21,34.29 | v46.1,34.04 46.1,33.91 43.39,31.2 MCU1.34
  Bottom 0.203: v46.1,34.04 45.05,34.04 43.94,35.15 42.24,35.15 41.38,34.29 v29.21,34.29
A7
  Top 0.203: MCU1.13 36.19,19.3 36.2,19.3 35.88,19.62 34.99,19.62 33.73,18.36 17.83,18.36 15.24,20.95 X6.4
A8
  Top 0.203: MCU1.32 45.03,27.12 44.45,27.12 44.02,27.55 44.02,29.44 51.91,37.34 X5.1
A10  (via drill 0.35)
  Top 0.203: MCU1.12 35.39,17.9 34.89,17.4 v26.29,17.4 | v25.53,14.59 24.51,15.6 16.08,15.6 13.81,13.34 X6.1
  Bottom 0.203: v26.29,17.4 26.29,15.47 25.53,14.71 v25.53,14.59
B4
  Top 0.203: MCU1.33 45.19,28.08 45.19,29.76 50.23,34.8 X5.2
B9  (via drill 0.35)
  Top 0.203: MCU1.1 33.4,27.95 v33.4,29.59 | v19.81,27.56 16.89,27.56 14.48,29.97 6.35,29.97 4.95,31.37 J3.3
  Bottom 0.203: v33.4,29.59 31.37,27.56 v19.81,27.56
C0
  Top 0.203: MCU1.25 45.76,21.55 46.74,20.57 46.74,19.81 48.01,18.54 53.85,18.54 59.18,13.21 X4.4
C1
  Top 0.203: MCU1.26 45.85,22.35 47.37,20.83 47.37,20.07 48.39,19.05 55.37,19.05 58.67,15.75 X4.3
C2
  Top 0.203: MCU1.27 45.81,23.15 48.01,20.95 48.01,20.45 48.77,19.68 57.02,19.68 58.42,18.29 X4.2
CLOCK
  Top 0.203: MCU1.30 45.09,25.52 45.67,25.52 46.86,26.71 Y1.3
GND  (via drill 0.35, 0.35 pad 0.82)
  Top 0.406: L2.C L1.C 58.33,1.14 55.12,1.14 53.21,3.05 v53.21,6.22 54.05,7.06 J1.GND 54.05,10.34 51.31,13.08 X1.3 | v35.31,15.24 35.91,14.63 C3.2 37.12,15.53 38.59,17 MCU1.16 38.61,18.3 v38.61,20.19 | v51.24,22.92 50.95,23.21 C6.2 49.33,23.19 49.2,23.19 47.64,24.75 MCU1.29 42.94,24.75 v42.93,24.77 | IC2.3 44.56,9.93 43.81,10.67 38.73,10.67 v38.48,10.41 | C10.2 55.31,24.2 54.61,24.89 v53.59,24.89 | IC4.2 23.11,6.99 25.15,4.95 v25.4,4.95 25.4,4.69 28.12,1.97 C9.2 | IC1.3 C4.2 39.18,1.78 U1.1 v34.04,1.78 32.99,1.78 32.29,1.07 30.21,1.07 29.31,1.97 C9.2 | C12.1 22.95,1.49 23.18,1.72 28.19,1.72 C9.2 | v35.75,23.18 34.98,23.95 MCU1.6 30.53,23.95 C8.2 29.46,25.78 v29.46,28.57 27.56,30.48 X2.1 | v40.01,27.69 39.39,28.3 MCU1.39 39.37,29.64 39.37,30.73 40.81,32.17 C5.2 41.95,34.42 v42.55,34.42 | Q1.2 15.27,36.76 10.03,42.01 VR1.3 | Y1.2 48.9,30.18 50.44,31.73 52.53,31.73 53.15,31.11 v54.48,31.11 55.88,29.72 X5.4 | PL1.C 29.98,7.97 29.98,11.14 30.82,11.98 v31.07,11.98 | v13.97,10.16 13.97,9.47 IC4.4 13.97,4.5 v13.97,3.81 12.7,2.54 v11.43,2.54
  Top 0.813: IC4.2 IC4.4
  Top 1.016: C11.2 19.39,11.62 16.46,8.69 IC4.4 16.16,7.28 12.06,7.28 D2.1
  Bottom 0.406: v29.46,28.57 29.46,29.84 26.04,33.27 J2.15 26.04,41.07 24.46,39.49 22.27,39.49 19.76,42.01 VR1.3 11.43,42.01 17.65,35.79 17.65,27.66 30.45,14.86 C7.- | C7.- 32.26,16.26 34.29,16.26 v35.31,15.24 | v38.48,10.41 38.23,10.67 35.05,10.67 C7.- | v51.24,22.92 51.18,22.99 51.18,24.13 51.94,24.89 v53.59,24.89 53.66,24.96 53.66,30.04 54.48,30.86 v54.48,31.11 | v53.21,6.22 48.77,1.78 v34.04,1.78 | v25.4,4.95 27.18,6.73 27.18,12.95 29.08,14.86 C7.- | v35.75,23.18 38.61,20.32 v38.61,20.19 42.93,24.51 v42.93,24.77 v40.01,27.69 | v42.55,34.42 43.95,34.42 45.94,32.44 53.16,32.44 v54.48,31.11 | v54.48,31.11 56.9,28.7 56.9,26.16 58.17,24.89 60.2,24.89 63.37,28.07 63.37,40.51 J2.1 | v31.07,11.98 30.86,12.19 C7.- | v16.51,11.43 15.24,11.43 v13.97,10.16 12.7,11.43 v11.43,11.43 | v13.97,3.81 15.24,2.54 v16.51,2.54
  pour Top (isolate 0.254): 0,0 0,45.01 64.9,45.01 64.9,0
  pour Bottom (isolate 0.254): 0,0 0,45.01 64.9,45.01 64.9,0
LCD_DB0
  Top 0.203: MCU1.41 37.79,30.54 36.45,31.88 36.45,33.4 40.26,37.21 42.55,37.21 46.35,41.02 J2.7
LCD_DB1
  Top 0.203: MCU1.42 36.99,30.45 35.69,31.75 35.69,34.54 40.77,39.62 42.55,39.62 43.81,40.89 J2.8
LCD_DB2
  Top 0.203: MCU1.43 36.12,29.69 36.12,30.36 34.92,31.56 34.92,34.92 41.27,41.27 J2.9
LCD_DB3
  Top 0.203: MCU1.44 35.39,30.13 34.16,31.35 34.16,35.43 38.23,39.5 38.23,41.78 J2.10
LCD_DB4
  Top 0.203: MCU1.2 33.05,27.15 32.85,27.34 32.84,27.34 32.38,27.8 32.38,37.21 36.2,41.02 J2.11
LCD_DB5
  Top 0.203: MCU1.3 32.83,26.35 31.75,27.43 31.75,39.12 33.66,41.02 J2.12
LCD_DB6
  Top 0.203: J2.13 31.11,27.18 32.74,25.55 MCU1.4
LCD_DB7
  Top 0.203: MCU1.5 32.66,24.75 30.48,26.92 30.48,38.61 28.57,40.51 J2.14
LCD_E
  Top 0.203: MCU1.38 40.19,30.48 43.76,34.06 43.76,35.26 48.9,40.39 J2.6
LCD_RS
  Top 0.203: MCU1.36 41.79,30.48 44.83,33.53 44.83,34.92 48.9,38.99 51.44,38.99 53.98,41.53 J2.4
LCD_RW
  Top 0.203: J2.5 51.44,41.08 49.75,39.4 48.6,39.4 44.3,35.09 44.3,33.76 40.99,30.45 MCU1.37
LED1  (via drill 0.35)
  Top 0.203: MCU1.19 40.96,18.25 40.96,17.67 42.55,16.08 45.52,16.08 v46.23,15.37 | R3.2 59.31,8.95 59.31,9.02 v56.13,12.19
  Bottom 0.203: v46.23,15.37 48.77,12.83 54.36,12.83 54.99,12.19 v56.13,12.19
LED2  (via drill 0.35)
  Top 0.203: MCU1.20 41.76,18.25 41.76,17.54 42.69,16.61 47.78,16.61 v48.13,16.26 | R5.2 61.66,8.7 58.75,11.61 58.02,11.61 54.96,14.67 v54.93,14.67
  Bottom 0.203: v54.93,14.67 54.86,14.73 49.66,14.73 v48.13,16.26
MCLR
  Top 0.203: MCU1.18 40.19,17.4 41.84,15.75 42.23,15.75 R2.1 43.75,14.22 49.05,14.22 X1.5
N$1
  Top 0.203: U1.4 37.27,5.59 39.12,3.74 C4.1
N$2
  Top 0.203: R3.1 L1.A
N$3
  Top 0.61: D1.2 10.37,35.81 5.46,35.81 J3.1 6.7,38.32 12.19,38.32 14.19,36.32 Q1.3
N$4  (via drill 0.35)
  Top 0.203: U1.2 35.54,3.05 v34.82,3.77 | IC1.2 41.66,2.79 41.02,3.43 41.02,4.83 v40.77,5.08
  Bottom 0.203: v34.82,3.77 36.39,5.33 40.51,5.33 v40.77,5.08
N$5  (via drill 0.35)
  Top 0.203: VR1.2 8.38,43.15 18.67,43.15 24.87,36.95 27.18,36.95 v27.3,36.83
  Bottom 0.203: J2.3 56.52,41.08 55.06,39.62 30.1,39.62 v27.3,36.83
N$6
  Top 0.203: R4.1 PL1.A
N$7
  Top 0.203: R5.1 L2.A
N$8
  Top 1.016: J5.2 4.19,3.51 8.83,3.51 D2.2
  Bottom 1.016: 3.81,4.07 J5.2
  Bottom 1.27: J4.2 3.81,13.58 6.53,10.86 6.53,6.79 3.81,4.07
N$9
  Top 0.406: C11.1 22.27,12.57 22.27,9.68 IC4.3 23.04,9.67 23.04,10.43 25.06,12.45 J6.1
N$14  (via drill 0.35)
  Top 0.203: v34.8,7.49 34.8,5.72 36.2,4.32 U1.3 | IC2.4 41.8,9.84 41.11,9.14 v38.48,9.14
  Bottom 0.203: v38.48,9.14 36.45,9.14 v34.8,7.49
PGEC
  Top 0.203: MCU1.22 43.39,17.64 51.45,17.64 53.31,15.78 X1.1
PGED
  Top 0.203: MCU1.21 42.59,17.48 42.93,17.14 51.18,17.14 52.31,16.02 X1.2
PWM1H1
  Top 0.203: MCU1.14 36.99,17.43 36.32,16.76 29.07,16.76 28.08,15.77 26.46,15.77 25.34,16.89 16.13,16.89 14.61,18.41 X6.3
PWM1H2
  Top 0.203: MCU1.10 32.31,20.75 31.24,19.68 21.72,19.68 15.37,26.04 X6.6
PWM1H3
  Top 0.203: MCU1.8 31.87,22.35 30.48,20.95 27.94,20.95 22,26.9 21.97,26.9 16.29,32.58 Q1.1
PWM1L1
  Top 0.203: MCU1.15 37.79,17.21 36.67,16.1 29.24,16.1 28.38,15.24 26.16,15.24 25.15,16.26 14.22,16.26 13.84,15.88 X6.2
PWM1L2
  Top 0.203: MCU1.11 32.52,19.95 31.62,19.05 19.81,19.05 15.37,23.5 X6.5
PWM1L3
  Top 0.203: MCU1.9 32.09,21.55 30.86,20.32 22.1,20.32 14.35,28.07 5.59,28.07 J3.4
U1RX  (via drill 0.35 pad 0.82)
  Top 0.203: MCU1.23 45.21,19.8 v45.21,18.67 | IC1.4 45.72,3.01 v45.72,5.08
  Bottom 0.203: v45.21,18.67 45.21,13.31 48.01,10.52 48.01,7.37 v45.72,5.08
U1TX  (via drill 0.35 pad 0.82)
  Top 0.203: MCU1.24 44.24,20.75 v43.43,19.94 | v45.85,10.29 45.85,9.16 45.57,8.89 IC2.2
  Bottom 0.203: v43.43,19.94 43.43,12.7 v45.85,10.29
USB_N
  Top 0.203: J1.D- 51.65,6.6 51.85,6.4 51.85,6.09 50.85,5.09 48.26,5.09 46.72,6.63 38.77,6.63 37.27,8.13 U1.6
USB_P
  Top 0.203: J1.D+ 52.45,6.62 52.25,6.42 52.25,5.79 51.02,4.55 48.09,4.55 46.55,6.1 38.61,6.1 37.85,6.86 U1.5
VBUS
  Top 0.406: J1.VBUS 50.85,9.74 50.22,10.37 47.41,10.37 46.26,11.53 34.9,11.53 33.27,9.91 33.27,2.92 32.13,1.78 U1.16 30.78,1.78 28.68,3.87 C9.1 28.45,4.45 J6.3
VCAP
  Top 0.203: 29.79,23.15 C8.1
  Top 0.406: MCU1.7 29.79,23.15